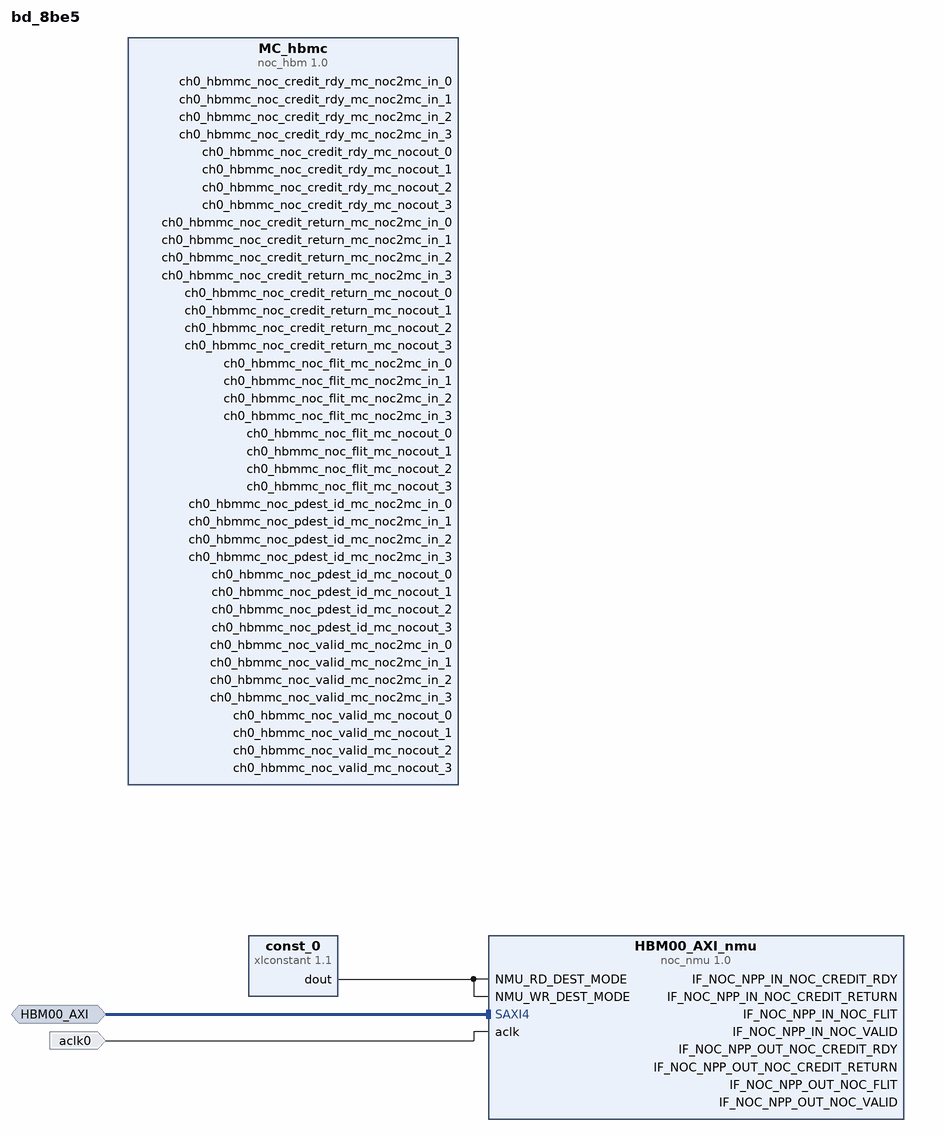
[diagram p0: block diagram of the top level]
# Vivado block design bd_8be5, xcvh1582-vsva3697-2MP-e-S, Vivado 2024.2
create_bd_design bd_8be5

create_bd_intf_port -mode Slave -vlnv xilinx.com:interface:aximm_rtl:1.0 HBM00_AXI
set_property -dict [list \
  CONFIG.CATEGORY pl_hbm \
  CONFIG.CONNECTIONS {HBM0_PORT0 {read_bw {12800} write_bw {12800} read_avg_burst {4} write_avg_burst {4}}} \
] [get_bd_intf_ports HBM00_AXI]
create_bd_port -dir I -type clk aclk0
set_property -dict {CONFIG.ASSOCIATED_BUSIF HBM00_AXI} [get_bd_ports aclk0]

create_bd_cell -type ip -vlnv xilinx.com:ip:noc_nmu:1.0 HBM00_AXI_nmu
set_property -dict [list \
  CONFIG.ATTR_FILE nocattrs.dat \
  CONFIG.IS_HBM true \
  CONFIG.USER_NOC_CATEGORY PL \
  CONFIG.USER_NOC_DATA512_WIDTH 256 \
  CONFIG.USER_NOC_NMU_WIDTH 256 \
  CONFIG.USER_PHYS_NAME NOC_NMU_HBM2E_X6Y0 \
  CONFIG.USER_REG_ADDR_DST0 0x00000 \
  CONFIG.USER_REG_ADDR_DST1 0x00000 \
  CONFIG.USER_REG_ADDR_DST2 0x00000 \
  CONFIG.USER_REG_ADDR_DST3 0x00000 \
  CONFIG.USER_REG_ADDR_DST4 0x00000 \
  CONFIG.USER_REG_ADDR_DST5 0x00000 \
  CONFIG.USER_REG_ADDR_DST6 0x00000 \
  CONFIG.USER_REG_ADDR_DST7 0x00000 \
  CONFIG.USER_REG_ADDR_DST8 0x00000 \
  CONFIG.USER_REG_ADDR_DST9 0x00000 \
  CONFIG.USER_REG_ADDR_DST10 0x00000 \
  CONFIG.USER_REG_ADDR_DST11 0x00000 \
  CONFIG.USER_REG_ADDR_DST12 0x00000 \
  CONFIG.USER_REG_ADDR_DST13 0x00000 \
  CONFIG.USER_REG_ADDR_DST14 0x00000 \
  CONFIG.USER_REG_ADDR_DST15 0x00000 \
  CONFIG.USER_REG_ADDR_ENABLE 0x0000 \
  CONFIG.USER_REG_ADDR_MADDR0 0x00000000 \
  CONFIG.USER_REG_ADDR_MADDR1 0x00000000 \
  CONFIG.USER_REG_ADDR_MADDR2 0x00000000 \
  CONFIG.USER_REG_ADDR_MADDR3 0x00000000 \
  CONFIG.USER_REG_ADDR_MADDR4 0x00000000 \
  CONFIG.USER_REG_ADDR_MADDR5 0x00000000 \
  CONFIG.USER_REG_ADDR_MADDR6 0x00000000 \
  CONFIG.USER_REG_ADDR_MADDR7 0x00000000 \
  CONFIG.USER_REG_ADDR_MADDR8 0x00000000 \
  CONFIG.USER_REG_ADDR_MADDR9 0x00000000 \
  CONFIG.USER_REG_ADDR_MADDR10 0x00000000 \
  CONFIG.USER_REG_ADDR_MADDR11 0x00000000 \
  CONFIG.USER_REG_ADDR_MADDR12 0x00000000 \
  CONFIG.USER_REG_ADDR_MADDR13 0x00000000 \
  CONFIG.USER_REG_ADDR_MADDR14 0x00000000 \
  CONFIG.USER_REG_ADDR_MADDR15 0x00000000 \
  CONFIG.USER_REG_ADDR_MASK0 0x00000000 \
  CONFIG.USER_REG_ADDR_MASK1 0x00000000 \
  CONFIG.USER_REG_ADDR_MASK2 0x00000000 \
  CONFIG.USER_REG_ADDR_MASK3 0x00000000 \
  CONFIG.USER_REG_ADDR_MASK4 0x00000000 \
  CONFIG.USER_REG_ADDR_MASK5 0x00000000 \
  CONFIG.USER_REG_ADDR_MASK6 0x00000000 \
  CONFIG.USER_REG_ADDR_MASK7 0x00000000 \
  CONFIG.USER_REG_ADDR_MASK8 0x00000000 \
  CONFIG.USER_REG_ADDR_MASK9 0x00000000 \
  CONFIG.USER_REG_ADDR_MASK10 0x00000000 \
  CONFIG.USER_REG_ADDR_MASK11 0x00000000 \
  CONFIG.USER_REG_ADDR_MASK12 0x00000000 \
  CONFIG.USER_REG_ADDR_MASK13 0x00000000 \
  CONFIG.USER_REG_ADDR_MASK14 0x00000000 \
  CONFIG.USER_REG_ADDR_MASK15 0x00000000 \
  CONFIG.USER_REG_ADDR_REMAP 0x0000 \
  CONFIG.USER_REG_ADDR_RPADDR0 0x00000000 \
  CONFIG.USER_REG_ADDR_RPADDR1 0x00000000 \
  CONFIG.USER_REG_ADDR_RPADDR2 0x00000000 \
  CONFIG.USER_REG_ADDR_RPADDR3 0x00000000 \
  CONFIG.USER_REG_ADDR_RPADDR4 0x00000000 \
  CONFIG.USER_REG_ADDR_RPADDR5 0x00000000 \
  CONFIG.USER_REG_ADDR_RPADDR6 0x00000000 \
  CONFIG.USER_REG_ADDR_RPADDR7 0x00000000 \
  CONFIG.USER_REG_ADDR_RPADDR8 0x00000000 \
  CONFIG.USER_REG_ADDR_RPADDR9 0x00000000 \
  CONFIG.USER_REG_ADDR_RPADDR10 0x00000000 \
  CONFIG.USER_REG_ADDR_RPADDR11 0x00000000 \
  CONFIG.USER_REG_ADDR_RPADDR12 0x00000000 \
  CONFIG.USER_REG_ADDR_RPADDR13 0x00000000 \
  CONFIG.USER_REG_ADDR_RPADDR14 0x00000000 \
  CONFIG.USER_REG_ADDR_RPADDR15 0x00000000 \
  CONFIG.USER_REG_ADR_MAP_CPM 0x0FC0 \
  CONFIG.USER_REG_ADR_MAP_FPD_AFI_0 0x0FC0 \
  CONFIG.USER_REG_ADR_MAP_FPD_AFI_1 0x0FC0 \
  CONFIG.USER_REG_ADR_MAP_LPD_AFI_FS 0x0FC0 \
  CONFIG.USER_REG_ADR_MAP_ME_ARRAY_0 0x0FC0 \
  CONFIG.USER_REG_ADR_MAP_ME_ARRAY_1 0x0FC0 \
  CONFIG.USER_REG_ADR_MAP_ME_ARRAY_2 0x0FC0 \
  CONFIG.USER_REG_ADR_MAP_ME_ARRAY_3 0x0FC0 \
  CONFIG.USER_REG_ADR_MAP_PCIE 0x0FC0 \
  CONFIG.USER_REG_ADR_MAP_PMC 0x0FC0 \
  CONFIG.USER_REG_ADR_MAP_PMC_ALIAS_0 0x0FC0 \
  CONFIG.USER_REG_ADR_MAP_PMC_ALIAS_1 0x0FC0 \
  CONFIG.USER_REG_ADR_MAP_PMC_ALIAS_2 0x0FC0 \
  CONFIG.USER_REG_ADR_MAP_PMC_ALIAS_3 0x0FC0 \
  CONFIG.USER_REG_ADR_MAP_QSPI 0x0FC0 \
  CONFIG.USER_REG_ADR_MAP_STM_GIC 0x0FC0 \
  CONFIG.USER_REG_ADR_MAP_USER_ID0 0x0000 \
  CONFIG.USER_REG_ADR_MAP_USER_ID1 0x0000 \
  CONFIG.USER_REG_ADR_MAP_USER_ID2 0x0000 \
  CONFIG.USER_REG_ADR_MAP_USER_ID3 0x0000 \
  CONFIG.USER_REG_ADR_MAP_USER_ID4 0x0000 \
  CONFIG.USER_REG_ADR_MAP_USER_ID5 0x0000 \
  CONFIG.USER_REG_ADR_MAP_USER_ID6 0x0000 \
  CONFIG.USER_REG_ADR_MAP_USER_ID7 0x0000 \
  CONFIG.USER_REG_ADR_MAP_XPDS 0x0FC0 \
  CONFIG.USER_REG_AXI_LOOPBACK 0x00 \
  CONFIG.USER_REG_AXI_NON_MOD_DISABLE 0x0 \
  CONFIG.USER_REG_AXI_PAR_CHK 0x0 \
  CONFIG.USER_REG_CHOPSIZE 0xA \
  CONFIG.USER_REG_DDR_ADR_MAP0 0x01FFF \
  CONFIG.USER_REG_DDR_ADR_MAP1 0x01FFF \
  CONFIG.USER_REG_DDR_ADR_MAP2 0x01FFF \
  CONFIG.USER_REG_DDR_ADR_MAP3 0x01FFF \
  CONFIG.USER_REG_DDR_ADR_MAP4 0x01FFF \
  CONFIG.USER_REG_DDR_ADR_MAP5 0x01FFF \
  CONFIG.USER_REG_DDR_ADR_MAP6 0x01FFF \
  CONFIG.USER_REG_DDR_DST_MAP0 0xFC0 \
  CONFIG.USER_REG_DDR_DST_MAP1 0xFC0 \
  CONFIG.USER_REG_DDR_DST_MAP2 0xFC0 \
  CONFIG.USER_REG_DDR_DST_MAP3 0xFC0 \
  CONFIG.USER_REG_DDR_DST_MAP4 0xFC0 \
  CONFIG.USER_REG_DDR_DST_MAP5 0xFC0 \
  CONFIG.USER_REG_DDR_DST_MAP6 0xFC0 \
  CONFIG.USER_REG_DDR_DST_MAP7 0xFC0 \
  CONFIG.USER_REG_DWIDTH 0x5 \
  CONFIG.USER_REG_ECC_CHK_EN 0x1 \
  CONFIG.USER_REG_HBM_MAP_T0_CH0 0x1080 \
  CONFIG.USER_REG_HBM_MAP_T0_CH1 0x0FC0 \
  CONFIG.USER_REG_HBM_MAP_T0_CH2 0x0FC0 \
  CONFIG.USER_REG_HBM_MAP_T0_CH3 0x0FC0 \
  CONFIG.USER_REG_HBM_MAP_T0_CH4 0x0FC0 \
  CONFIG.USER_REG_HBM_MAP_T0_CH5 0x0FC0 \
  CONFIG.USER_REG_HBM_MAP_T0_CH6 0x0FC0 \
  CONFIG.USER_REG_HBM_MAP_T0_CH7 0x0FC0 \
  CONFIG.USER_REG_HBM_MAP_T0_CH8 0x0FC0 \
  CONFIG.USER_REG_HBM_MAP_T0_CH9 0x0FC0 \
  CONFIG.USER_REG_HBM_MAP_T0_CH10 0x0FC0 \
  CONFIG.USER_REG_HBM_MAP_T0_CH11 0x0FC0 \
  CONFIG.USER_REG_HBM_MAP_T0_CH12 0x0FC0 \
  CONFIG.USER_REG_HBM_MAP_T0_CH13 0x0FC0 \
  CONFIG.USER_REG_HBM_MAP_T0_CH14 0x0FC0 \
  CONFIG.USER_REG_HBM_MAP_T0_CH15 0x0FC0 \
  CONFIG.USER_REG_HBM_MAP_T1_CH0 0x0FC0 \
  CONFIG.USER_REG_HBM_MAP_T1_CH1 0x0FC0 \
  CONFIG.USER_REG_HBM_MAP_T1_CH2 0x0FC0 \
  CONFIG.USER_REG_HBM_MAP_T1_CH3 0x0FC0 \
  CONFIG.USER_REG_HBM_MAP_T1_CH4 0x0FC0 \
  CONFIG.USER_REG_HBM_MAP_T1_CH5 0x0FC0 \
  CONFIG.USER_REG_HBM_MAP_T1_CH6 0x0FC0 \
  CONFIG.USER_REG_HBM_MAP_T1_CH7 0x0FC0 \
  CONFIG.USER_REG_HBM_MAP_T1_CH8 0x0FC0 \
  CONFIG.USER_REG_HBM_MAP_T1_CH9 0x0FC0 \
  CONFIG.USER_REG_HBM_MAP_T1_CH10 0x0FC0 \
  CONFIG.USER_REG_HBM_MAP_T1_CH11 0x0FC0 \
  CONFIG.USER_REG_HBM_MAP_T1_CH12 0x0FC0 \
  CONFIG.USER_REG_HBM_MAP_T1_CH13 0x0FC0 \
  CONFIG.USER_REG_HBM_MAP_T1_CH14 0x0FC0 \
  CONFIG.USER_REG_HBM_MAP_T1_CH15 0x0FC0 \
  CONFIG.USER_REG_HBM_MAP_T2_CH0 0x0FC0 \
  CONFIG.USER_REG_HBM_MAP_T2_CH1 0x0FC0 \
  CONFIG.USER_REG_HBM_MAP_T2_CH2 0x0FC0 \
  CONFIG.USER_REG_HBM_MAP_T2_CH3 0x0FC0 \
  CONFIG.USER_REG_HBM_MAP_T2_CH4 0x0FC0 \
  CONFIG.USER_REG_HBM_MAP_T2_CH5 0x0FC0 \
  CONFIG.USER_REG_HBM_MAP_T2_CH6 0x0FC0 \
  CONFIG.USER_REG_HBM_MAP_T2_CH7 0x0FC0 \
  CONFIG.USER_REG_HBM_MAP_T2_CH8 0x0FC0 \
  CONFIG.USER_REG_HBM_MAP_T2_CH9 0x0FC0 \
  CONFIG.USER_REG_HBM_MAP_T2_CH10 0x0FC0 \
  CONFIG.USER_REG_HBM_MAP_T2_CH11 0x0FC0 \
  CONFIG.USER_REG_HBM_MAP_T2_CH12 0x0FC0 \
  CONFIG.USER_REG_HBM_MAP_T2_CH13 0x0FC0 \
  CONFIG.USER_REG_HBM_MAP_T2_CH14 0x0FC0 \
  CONFIG.USER_REG_HBM_MAP_T2_CH15 0x0FC0 \
  CONFIG.USER_REG_HBM_MAP_T3_CH0 0x0FC0 \
  CONFIG.USER_REG_HBM_MAP_T3_CH1 0x0FC0 \
  CONFIG.USER_REG_HBM_MAP_T3_CH2 0x0FC0 \
  CONFIG.USER_REG_HBM_MAP_T3_CH3 0x0FC0 \
  CONFIG.USER_REG_HBM_MAP_T3_CH4 0x0FC0 \
  CONFIG.USER_REG_HBM_MAP_T3_CH5 0x0FC0 \
  CONFIG.USER_REG_HBM_MAP_T3_CH6 0x0FC0 \
  CONFIG.USER_REG_HBM_MAP_T3_CH7 0x0FC0 \
  CONFIG.USER_REG_HBM_MAP_T3_CH8 0x0FC0 \
  CONFIG.USER_REG_HBM_MAP_T3_CH9 0x0FC0 \
  CONFIG.USER_REG_HBM_MAP_T3_CH10 0x0FC0 \
  CONFIG.USER_REG_HBM_MAP_T3_CH11 0x0FC0 \
  CONFIG.USER_REG_HBM_MAP_T3_CH12 0x0FC0 \
  CONFIG.USER_REG_HBM_MAP_T3_CH13 0x0FC0 \
  CONFIG.USER_REG_HBM_MAP_T3_CH14 0x0FC0 \
  CONFIG.USER_REG_HBM_MAP_T3_CH15 0x0FC0 \
  CONFIG.USER_REG_HPHY_MODE 0x0 \
  CONFIG.USER_REG_MODE_SELECT 0x0020 \
  CONFIG.USER_REG_OUTSTANDING_RD_TXN 0x40 \
  CONFIG.USER_REG_OUTSTANDING_WR_TXN 0x40 \
  CONFIG.USER_REG_PRIORITY 0x0 \
  CONFIG.USER_REG_QOS 0x00 \
  CONFIG.USER_REG_RD_AXPROT_SEL 0x00 \
  CONFIG.USER_REG_RD_RATE_CREDIT_DROP 0x004 \
  CONFIG.USER_REG_RD_RATE_CREDIT_LIMIT 0x0100 \
  CONFIG.USER_REG_RD_VCA_TOKEN0 0x1C \
  CONFIG.USER_REG_RPOISON_TO_SLVERR 0x0 \
  CONFIG.USER_REG_RROB_RAM_SETTING 0x012 \
  CONFIG.USER_REG_SMID_SEL 0x00000 \
  CONFIG.USER_REG_SRC 0x040 \
  CONFIG.USER_REG_TBASE_AXI_TIMEOUT 0x1 \
  CONFIG.USER_REG_TBASE_MODE_RLIMIT_RD 0x2 \
  CONFIG.USER_REG_TBASE_MODE_RLIMIT_WR 0x2 \
  CONFIG.USER_REG_TBASE_TRK_TIMEOUT 0x1 \
  CONFIG.USER_REG_VC_MAP 0xFAC \
  CONFIG.USER_REG_WBUF_LAUNCH_SIZE 0x10 \
  CONFIG.USER_REG_WBUF_RAM_SETTING 0x012 \
  CONFIG.USER_REG_WR_AXPROT_SEL 0x00 \
  CONFIG.USER_REG_WR_RATE_CREDIT_DROP 0x004 \
  CONFIG.USER_REG_WR_RATE_CREDIT_LIMIT 0x0100 \
  CONFIG.USER_REG_WR_VCA_TOKEN0 0xFF \
] [get_bd_cells HBM00_AXI_nmu]
create_bd_cell -type ip -vlnv xilinx.com:ip:xlconstant:1.1 const_0
set_property -dict {CONFIG.CONST_VAL 0 CONFIG.CONST_WIDTH 1} [get_bd_cells const_0]
create_bd_cell -type ip -vlnv xilinx.com:ip:noc_hbm:1.0 MC_hbmc
set_property -dict [list \
  CONFIG.HBM_AP_BASE_CONFIG HBM_CHNL0_CONFIG \
  CONFIG.HBM_ATTR_FILE nocattrs.dat \
  CONFIG.HBM_AUTO_POPULATE yes \
  CONFIG.HBM_CHNL0_CONFIG {['HBM_REORDER_EN FALSE HBM_MAINTAIN_COHERENCY TRUE HBM_Q_AGE_LIMIT 0x7f HBM_CLOSE_PAGE_REORDER FALSE HBM_LOOKAHEAD_PCH TRUE HBM_COMMAND_PARITY FALSE HBM_DQ_WR_PARITY FALSE HBM_DQ_RD_PARITY FALSE', 'HBM_RD_DBI TRUE HBM_WR_DBI TRUE HBM_REFRESH_MODE ALL_BANK_REFRESH HBM_PC0_PRE_DEFINED_ADDRESS_MAP ROW_BANK_COLUMN_BGO HBM_PC1_PRE_DEFINED_ADDRESS_MAP ROW_BANK_COLUMN_BGO', 'HBM_PC0_USER_DEFINED_ADDRESS_MAP NONE HBM_PC1_USER_DEFINED_ADDRESS_MAP NONE HBM_PC0_ADDRESS_MAP', 'RA14,RA13,RA12,RA11,RA10,RA9,RA8,RA7,RA6,RA5,RA4,RA3,RA2,RA1,RA0,SID,BA1,BA0,BA3,CA5,CA4,CA3,CA2,CA1,BA2,NC,NA,NA,NA,NA HBM_PC1_ADDRESS_MAP', 'RA14,RA13,RA12,RA11,RA10,RA9,RA8,RA7,RA6,RA5,RA4,RA3,RA2,RA1,RA0,SID,BA1,BA0,BA3,CA5,CA4,CA3,CA2,CA1,BA2,NC,NA,NA,NA,NA HBM_PWR_DWN_IDLE_TIMEOUT_ENTRY FALSE HBM_SELF_REF_IDLE_TIMEOUT_ENTRY FALSE', 'HBM_IDLE_TIME_TO_ENTER_PWR_DWN_MODE 0x0001000 HBM_IDLE_TIME_TO_ENTER_SELF_REF_MODE 1X HBM_ECC_CORRECTION_EN FALSE HBM_WRITE_BACK_CORRECTED_DATA TRUE HBM_ECC_SCRUBBING FALSE HBM_ECC_INITIALIZE_EN FALSE', 'HBM_ECC_SCRUB_SIZE 1092 HBM_WRITE_DATA_MASK TRUE HBM_REF_PERIOD_TEMP_COMP FALSE HBM_PARITY_LATENCY 3 HBM_PC0_PAGE_HIT 100.000 HBM_PC1_PAGE_HIT 100.000 HBM_PC0_READ_RATE 25.000 HBM_PC1_READ_RATE 25.000', 'HBM_PC0_WRITE_RATE 25.000 HBM_PC1_WRITE_RATE 25.000 HBM_PC0_PHY_ACTIVE ENABLED HBM_PC1_PHY_ACTIVE ENABLED HBM_PC0_SCRUB_START_ADDRESS 0x0000000 HBM_PC0_SCRUB_END_ADDRESS 0x3FFFBFF', 'HBM_PC0_SCRUB_INTERVAL 24.000 HBM_PC1_SCRUB_START_ADDRESS 0x0000000 HBM_PC1_SCRUB_END_ADDRESS 0x3FFFBFF HBM_PC1_SCRUB_INTERVAL 24.000']} \
  CONFIG.HBM_CHNL0_NA0_CONFIG {['HBMMC_NA0_NA_VC_MAP 0x0000000f HBMMC_NA0_NA_DEST_ID 0x00000080 HBMMC_NA0_PORT_INTERLEAVE 0x00000000 HBMMC_NA0_SCRUB_START_ADDRESS 0x00000000 HBMMC_NA0_SCRUB_END_ADDRESS 0x0000000e', 'HBMMC_NA0_SCRUB_FREQUENCY 0x003edd41 HBMMC_NA0_EXMON_CLR_EXE_CFG_DYN_MCP3 0x00000100 HBMMC_NA0_RD_CMD_MODE_CFG_MCP 0x00000000 HBMMC_NA0_WRCMD_PIPELINE_TIMEOUT_VALUE_CFG_MCP 0x00000000', 'HBMMC_NA0_WRCMD_PIPELINE_TIMEOUT_ENABLE_CFG_MCP 0x00000000 HBMMC_NA0_NA_ERR_INJ 0x00000000 HBMMC_NA0_NA_NSU_FORCE_ECC_FLIT_ERR 0x00000000 HBMMC_NA0_NA_PM_FILTR_P0 0x00000000', 'HBMMC_NA0_NA_PM_SMID_FILTR_P0 0x00000000 HBMMC_NA0_NA_PM_FILTR_EN_P0 0x00000000 HBMMC_NA0_NA_PM_FILTR_P1 0x00000000 HBMMC_NA0_NA_PM_SMID_FILTR_P1 0x00000000 HBMMC_NA0_NA_PM_FILTR_EN_P1 0x00000000', 'HBMMC_NA0_TGC_CONFIG 0x00000000 HBMMC_NA0_XMPU_CTRL_CFG_DYN_MCP3 0x0000000b HBMMC_NA0_XMPU_START_LO0_CFG_DYN_MCP3 0x00000000 HBMMC_NA0_XMPU_START_HI0_CFG_DYN_MCP3 0x00000000', 'HBMMC_NA0_XMPU_END_LO0_CFG_DYN_MCP3 0x00000000 HBMMC_NA0_XMPU_END_HI0_CFG_DYN_MCP3 0x00000000 HBMMC_NA0_XMPU_MASTER0_CFG_DYN_MCP3 0x00000000 HBMMC_NA0_XMPU_CONFIG0_CFG_DYN_MCP3 0x00000008', 'HBMMC_NA0_XMPU_START_LO1_CFG_DYN_MCP3 0x00000000 HBMMC_NA0_XMPU_START_HI1_CFG_DYN_MCP3 0x00000000 HBMMC_NA0_XMPU_END_LO1_CFG_DYN_MCP3 0x00000000 HBMMC_NA0_XMPU_END_HI1_CFG_DYN_MCP3 0x00000000', 'HBMMC_NA0_XMPU_MASTER1_CFG_DYN_MCP3 0x00000000 HBMMC_NA0_XMPU_CONFIG1_CFG_DYN_MCP3 0x00000008']} \
  CONFIG.HBM_CHNL0_NA1_CONFIG {['HBMMC_NA1_NA_VC_MAP 0x00000000 HBMMC_NA1_NA_DEST_ID 0x00000000 HBMMC_NA1_PORT_INTERLEAVE 0x00000000 HBMMC_NA1_SCRUB_START_ADDRESS 0x00000000 HBMMC_NA1_SCRUB_END_ADDRESS 0x0000000e', 'HBMMC_NA1_SCRUB_FREQUENCY 0x003edd41 HBMMC_NA1_EXMON_CLR_EXE_CFG_DYN_MCP3 0x00000100 HBMMC_NA1_RD_CMD_MODE_CFG_MCP 0x00000000 HBMMC_NA1_WRCMD_PIPELINE_TIMEOUT_VALUE_CFG_MCP 0x00000000', 'HBMMC_NA1_WRCMD_PIPELINE_TIMEOUT_ENABLE_CFG_MCP 0x00000000 HBMMC_NA1_NA_ERR_INJ 0x00000000 HBMMC_NA1_NA_NSU_FORCE_ECC_FLIT_ERR 0x00000000 HBMMC_NA1_NA_PM_FILTR_P0 0x00000000', 'HBMMC_NA1_NA_PM_SMID_FILTR_P0 0x00000000 HBMMC_NA1_NA_PM_FILTR_EN_P0 0x00000000 HBMMC_NA1_NA_PM_FILTR_P1 0x00000000 HBMMC_NA1_NA_PM_SMID_FILTR_P1 0x00000000 HBMMC_NA1_NA_PM_FILTR_EN_P1 0x00000000', 'HBMMC_NA1_TGC_CONFIG 0x00000000 HBMMC_NA1_XMPU_CTRL_CFG_DYN_MCP3 0x0000000b HBMMC_NA1_XMPU_START_LO0_CFG_DYN_MCP3 0x00000000 HBMMC_NA1_XMPU_START_HI0_CFG_DYN_MCP3 0x00000000', 'HBMMC_NA1_XMPU_END_LO0_CFG_DYN_MCP3 0x00000000 HBMMC_NA1_XMPU_END_HI0_CFG_DYN_MCP3 0x00000000 HBMMC_NA1_XMPU_MASTER0_CFG_DYN_MCP3 0x00000000 HBMMC_NA1_XMPU_CONFIG0_CFG_DYN_MCP3 0x00000008', 'HBMMC_NA1_XMPU_START_LO1_CFG_DYN_MCP3 0x00000000 HBMMC_NA1_XMPU_START_HI1_CFG_DYN_MCP3 0x00000000 HBMMC_NA1_XMPU_END_LO1_CFG_DYN_MCP3 0x00000000 HBMMC_NA1_XMPU_CONFIG1_CFG_DYN_MCP3 0x00000008']} \
  CONFIG.HBM_CHNL10_CONFIG { } \
  CONFIG.HBM_CHNL11_CONFIG { } \
  CONFIG.HBM_CHNL12_CONFIG { } \
  CONFIG.HBM_CHNL13_CONFIG { } \
  CONFIG.HBM_CHNL14_CONFIG { } \
  CONFIG.HBM_CHNL15_CONFIG { } \
  CONFIG.HBM_CHNL1_CONFIG { } \
  CONFIG.HBM_CHNL2_CONFIG { } \
  CONFIG.HBM_CHNL3_CONFIG { } \
  CONFIG.HBM_CHNL4_CONFIG { } \
  CONFIG.HBM_CHNL5_CONFIG { } \
  CONFIG.HBM_CHNL6_CONFIG { } \
  CONFIG.HBM_CHNL7_CONFIG { } \
  CONFIG.HBM_CHNL8_CONFIG { } \
  CONFIG.HBM_CHNL9_CONFIG { } \
  CONFIG.HBM_CHNL_EN_0 true \
  CONFIG.HBM_CHNL_EN_1 false \
  CONFIG.HBM_CHNL_EN_2 false \
  CONFIG.HBM_CHNL_EN_3 false \
  CONFIG.HBM_CHNL_EN_4 false \
  CONFIG.HBM_CHNL_EN_5 false \
  CONFIG.HBM_CHNL_EN_6 false \
  CONFIG.HBM_CHNL_EN_7 false \
  CONFIG.HBM_CHNL_EN_8 false \
  CONFIG.HBM_CHNL_EN_9 false \
  CONFIG.HBM_CHNL_EN_10 false \
  CONFIG.HBM_CHNL_EN_11 false \
  CONFIG.HBM_CHNL_EN_12 false \
  CONFIG.HBM_CHNL_EN_13 false \
  CONFIG.HBM_CHNL_EN_14 false \
  CONFIG.HBM_CHNL_EN_15 false \
  CONFIG.HBM_CHNL_PARAM 0 \
  CONFIG.HBM_CTRL_PHY_MODE Controller_and_Physical_Layer \
  CONFIG.HBM_DFI_CLK_DIV2_EN false \
  CONFIG.HBM_EXT_REFCLK_IO_STANDARD NONE \
  CONFIG.HBM_FCV_PARAM Disable \
  CONFIG.HBM_GBL_REF_RST_EN false \
  CONFIG.HBM_HPLL_TEST_PORTS_EN false \
  CONFIG.HBM_MEMORY_FREQ0 1600 \
  CONFIG.HBM_MEMORY_FREQ1 1600 \
  CONFIG.HBM_MEMORY_MODEL xilinx_responder \
  CONFIG.HBM_MEM_BACKDOOR_WRITE false \
  CONFIG.HBM_MEM_INIT_FILE no_file_loaded \
  CONFIG.HBM_MEM_INIT_MODE INIT_0 \
  CONFIG.HBM_OVERWRITE_PORTCONTROL_REG false \
  CONFIG.HBM_PHYIO_CNTRL_BLOCK false \
  CONFIG.HBM_PHY_DEBUG_PORTS_EN false \
  CONFIG.HBM_PHY_EN_0 false \
  CONFIG.HBM_PHY_EN_1 false \
  CONFIG.HBM_PHY_EN_2 false \
  CONFIG.HBM_PHY_EN_3 false \
  CONFIG.HBM_PHY_EN_4 false \
  CONFIG.HBM_PHY_EN_5 false \
  CONFIG.HBM_PHY_EN_6 false \
  CONFIG.HBM_PHY_EN_7 false \
  CONFIG.HBM_PHY_EN_8 false \
  CONFIG.HBM_PHY_EN_9 false \
  CONFIG.HBM_PHY_EN_10 false \
  CONFIG.HBM_PHY_EN_11 false \
  CONFIG.HBM_PHY_EN_12 false \
  CONFIG.HBM_PHY_EN_13 false \
  CONFIG.HBM_PHY_EN_14 false \
  CONFIG.HBM_PHY_EN_15 false \
  CONFIG.HBM_REF_CLK_FREQ0 100.000 \
  CONFIG.HBM_REF_CLK_FREQ1 100.000 \
  CONFIG.HBM_REF_CLK_SELECTION Internal \
  CONFIG.HBM_SIMULATION_MODE BFM \
  CONFIG.HBM_STACK0_CONFIG 0 \
  CONFIG.HBM_STACKS 1 \
  CONFIG.HBM_VNC_EN false \
] [get_bd_cells MC_hbmc]

# ---- connections ----

connect_bd_intf_net [get_bd_intf_ports HBM00_AXI] [get_bd_intf_pins HBM00_AXI_nmu/SAXI4]
connect_bd_net -net aclk0_1 [get_bd_ports aclk0] [get_bd_pins HBM00_AXI_nmu/aclk]
connect_bd_net [get_bd_pins const_0/dout] [get_bd_pins HBM00_AXI_nmu/NMU_RD_DEST_MODE] [get_bd_pins HBM00_AXI_nmu/NMU_WR_DEST_MODE]
# net hbm00_axi_nmu_if_noc_npp_in_noc_credit_rdy has one end: HBM00_AXI_nmu/IF_NOC_NPP_IN_NOC_CREDIT_RDY
# net hbm00_axi_nmu_if_noc_npp_in_noc_credit_return has one end: HBM00_AXI_nmu/IF_NOC_NPP_IN_NOC_CREDIT_RETURN
# net hbm00_axi_nmu_if_noc_npp_in_noc_flit has one end: HBM00_AXI_nmu/IF_NOC_NPP_IN_NOC_FLIT
# net hbm00_axi_nmu_if_noc_npp_in_noc_valid has one end: HBM00_AXI_nmu/IF_NOC_NPP_IN_NOC_VALID
# net hbm00_axi_nmu_if_noc_npp_out_noc_credit_rdy has one end: HBM00_AXI_nmu/IF_NOC_NPP_OUT_NOC_CREDIT_RDY
# net hbm00_axi_nmu_if_noc_npp_out_noc_credit_return has one end: HBM00_AXI_nmu/IF_NOC_NPP_OUT_NOC_CREDIT_RETURN
# net hbm00_axi_nmu_if_noc_npp_out_noc_flit has one end: HBM00_AXI_nmu/IF_NOC_NPP_OUT_NOC_FLIT
# net hbm00_axi_nmu_if_noc_npp_out_noc_valid has one end: HBM00_AXI_nmu/IF_NOC_NPP_OUT_NOC_VALID
# net mc_hbmc_ch0_hbmmc_noc_credit_rdy_mc_noc2mc_in_0 has one end: MC_hbmc/ch0_hbmmc_noc_credit_rdy_mc_noc2mc_in_0
# net mc_hbmc_ch0_hbmmc_noc_credit_rdy_mc_noc2mc_in_1 has one end: MC_hbmc/ch0_hbmmc_noc_credit_rdy_mc_noc2mc_in_1
# net mc_hbmc_ch0_hbmmc_noc_credit_rdy_mc_noc2mc_in_2 has one end: MC_hbmc/ch0_hbmmc_noc_credit_rdy_mc_noc2mc_in_2
# net mc_hbmc_ch0_hbmmc_noc_credit_rdy_mc_noc2mc_in_3 has one end: MC_hbmc/ch0_hbmmc_noc_credit_rdy_mc_noc2mc_in_3
# net mc_hbmc_ch0_hbmmc_noc_credit_rdy_mc_nocout_0 has one end: MC_hbmc/ch0_hbmmc_noc_credit_rdy_mc_nocout_0
# net mc_hbmc_ch0_hbmmc_noc_credit_rdy_mc_nocout_1 has one end: MC_hbmc/ch0_hbmmc_noc_credit_rdy_mc_nocout_1
# net mc_hbmc_ch0_hbmmc_noc_credit_rdy_mc_nocout_2 has one end: MC_hbmc/ch0_hbmmc_noc_credit_rdy_mc_nocout_2
# net mc_hbmc_ch0_hbmmc_noc_credit_rdy_mc_nocout_3 has one end: MC_hbmc/ch0_hbmmc_noc_credit_rdy_mc_nocout_3
# net mc_hbmc_ch0_hbmmc_noc_credit_return_mc_noc2mc_in_0 has one end: MC_hbmc/ch0_hbmmc_noc_credit_return_mc_noc2mc_in_0
# net mc_hbmc_ch0_hbmmc_noc_credit_return_mc_noc2mc_in_1 has one end: MC_hbmc/ch0_hbmmc_noc_credit_return_mc_noc2mc_in_1
# net mc_hbmc_ch0_hbmmc_noc_credit_return_mc_noc2mc_in_2 has one end: MC_hbmc/ch0_hbmmc_noc_credit_return_mc_noc2mc_in_2
# net mc_hbmc_ch0_hbmmc_noc_credit_return_mc_noc2mc_in_3 has one end: MC_hbmc/ch0_hbmmc_noc_credit_return_mc_noc2mc_in_3
# net mc_hbmc_ch0_hbmmc_noc_credit_return_mc_nocout_0 has one end: MC_hbmc/ch0_hbmmc_noc_credit_return_mc_nocout_0
# net mc_hbmc_ch0_hbmmc_noc_credit_return_mc_nocout_1 has one end: MC_hbmc/ch0_hbmmc_noc_credit_return_mc_nocout_1
# net mc_hbmc_ch0_hbmmc_noc_credit_return_mc_nocout_2 has one end: MC_hbmc/ch0_hbmmc_noc_credit_return_mc_nocout_2
# net mc_hbmc_ch0_hbmmc_noc_credit_return_mc_nocout_3 has one end: MC_hbmc/ch0_hbmmc_noc_credit_return_mc_nocout_3
# net mc_hbmc_ch0_hbmmc_noc_flit_mc_noc2mc_in_0 has one end: MC_hbmc/ch0_hbmmc_noc_flit_mc_noc2mc_in_0
# net mc_hbmc_ch0_hbmmc_noc_flit_mc_noc2mc_in_1 has one end: MC_hbmc/ch0_hbmmc_noc_flit_mc_noc2mc_in_1
# net mc_hbmc_ch0_hbmmc_noc_flit_mc_noc2mc_in_2 has one end: MC_hbmc/ch0_hbmmc_noc_flit_mc_noc2mc_in_2
# net mc_hbmc_ch0_hbmmc_noc_flit_mc_noc2mc_in_3 has one end: MC_hbmc/ch0_hbmmc_noc_flit_mc_noc2mc_in_3
# net mc_hbmc_ch0_hbmmc_noc_flit_mc_nocout_0 has one end: MC_hbmc/ch0_hbmmc_noc_flit_mc_nocout_0
# net mc_hbmc_ch0_hbmmc_noc_flit_mc_nocout_1 has one end: MC_hbmc/ch0_hbmmc_noc_flit_mc_nocout_1
# net mc_hbmc_ch0_hbmmc_noc_flit_mc_nocout_2 has one end: MC_hbmc/ch0_hbmmc_noc_flit_mc_nocout_2
# net mc_hbmc_ch0_hbmmc_noc_flit_mc_nocout_3 has one end: MC_hbmc/ch0_hbmmc_noc_flit_mc_nocout_3
# net mc_hbmc_ch0_hbmmc_noc_pdest_id_mc_noc2mc_in_0 has one end: MC_hbmc/ch0_hbmmc_noc_pdest_id_mc_noc2mc_in_0
# net mc_hbmc_ch0_hbmmc_noc_pdest_id_mc_noc2mc_in_1 has one end: MC_hbmc/ch0_hbmmc_noc_pdest_id_mc_noc2mc_in_1
# net mc_hbmc_ch0_hbmmc_noc_pdest_id_mc_noc2mc_in_2 has one end: MC_hbmc/ch0_hbmmc_noc_pdest_id_mc_noc2mc_in_2
# net mc_hbmc_ch0_hbmmc_noc_pdest_id_mc_noc2mc_in_3 has one end: MC_hbmc/ch0_hbmmc_noc_pdest_id_mc_noc2mc_in_3
# net mc_hbmc_ch0_hbmmc_noc_pdest_id_mc_nocout_0 has one end: MC_hbmc/ch0_hbmmc_noc_pdest_id_mc_nocout_0
# net mc_hbmc_ch0_hbmmc_noc_pdest_id_mc_nocout_1 has one end: MC_hbmc/ch0_hbmmc_noc_pdest_id_mc_nocout_1
# net mc_hbmc_ch0_hbmmc_noc_pdest_id_mc_nocout_2 has one end: MC_hbmc/ch0_hbmmc_noc_pdest_id_mc_nocout_2
# net mc_hbmc_ch0_hbmmc_noc_pdest_id_mc_nocout_3 has one end: MC_hbmc/ch0_hbmmc_noc_pdest_id_mc_nocout_3
# net mc_hbmc_ch0_hbmmc_noc_valid_mc_noc2mc_in_0 has one end: MC_hbmc/ch0_hbmmc_noc_valid_mc_noc2mc_in_0
# net mc_hbmc_ch0_hbmmc_noc_valid_mc_noc2mc_in_1 has one end: MC_hbmc/ch0_hbmmc_noc_valid_mc_noc2mc_in_1
# net mc_hbmc_ch0_hbmmc_noc_valid_mc_noc2mc_in_2 has one end: MC_hbmc/ch0_hbmmc_noc_valid_mc_noc2mc_in_2
# net mc_hbmc_ch0_hbmmc_noc_valid_mc_noc2mc_in_3 has one end: MC_hbmc/ch0_hbmmc_noc_valid_mc_noc2mc_in_3
# net mc_hbmc_ch0_hbmmc_noc_valid_mc_nocout_0 has one end: MC_hbmc/ch0_hbmmc_noc_valid_mc_nocout_0
# net mc_hbmc_ch0_hbmmc_noc_valid_mc_nocout_1 has one end: MC_hbmc/ch0_hbmmc_noc_valid_mc_nocout_1
# net mc_hbmc_ch0_hbmmc_noc_valid_mc_nocout_2 has one end: MC_hbmc/ch0_hbmmc_noc_valid_mc_nocout_2
# net mc_hbmc_ch0_hbmmc_noc_valid_mc_nocout_3 has one end: MC_hbmc/ch0_hbmmc_noc_valid_mc_nocout_3
set_property HDL_ATTRIBUTE.DONT_TOUCH true [get_bd_cells HBM00_AXI_nmu]
set_property HDL_ATTRIBUTE.DONT_TOUCH true [get_bd_cells const_0]
set_property HDL_ATTRIBUTE.DONT_TOUCH true [get_bd_cells MC_hbmc]
set_property HDL_ATTRIBUTE.EXT_CONN TRUE [get_bd_nets hbm00_axi_nmu_if_noc_npp_in_noc_credit_rdy]
set_property HDL_ATTRIBUTE.HIDDEN TRUE [get_bd_nets hbm00_axi_nmu_if_noc_npp_in_noc_credit_rdy]
set_property HDL_ATTRIBUTE.SIM_ONLY TRUE [get_bd_nets hbm00_axi_nmu_if_noc_npp_in_noc_credit_rdy]
set_property HDL_ATTRIBUTE.EXT_CONN TRUE [get_bd_nets hbm00_axi_nmu_if_noc_npp_in_noc_credit_return]
set_property HDL_ATTRIBUTE.HIDDEN TRUE [get_bd_nets hbm00_axi_nmu_if_noc_npp_in_noc_credit_return]
set_property HDL_ATTRIBUTE.SIM_ONLY TRUE [get_bd_nets hbm00_axi_nmu_if_noc_npp_in_noc_credit_return]
set_property HDL_ATTRIBUTE.EXT_CONN TRUE [get_bd_nets hbm00_axi_nmu_if_noc_npp_in_noc_flit]
set_property HDL_ATTRIBUTE.HIDDEN TRUE [get_bd_nets hbm00_axi_nmu_if_noc_npp_in_noc_flit]
set_property HDL_ATTRIBUTE.SIM_ONLY TRUE [get_bd_nets hbm00_axi_nmu_if_noc_npp_in_noc_flit]
set_property HDL_ATTRIBUTE.EXT_CONN TRUE [get_bd_nets hbm00_axi_nmu_if_noc_npp_in_noc_valid]
set_property HDL_ATTRIBUTE.HIDDEN TRUE [get_bd_nets hbm00_axi_nmu_if_noc_npp_in_noc_valid]
set_property HDL_ATTRIBUTE.SIM_ONLY TRUE [get_bd_nets hbm00_axi_nmu_if_noc_npp_in_noc_valid]
set_property HDL_ATTRIBUTE.EXT_CONN TRUE [get_bd_nets hbm00_axi_nmu_if_noc_npp_out_noc_credit_rdy]
set_property HDL_ATTRIBUTE.HIDDEN TRUE [get_bd_nets hbm00_axi_nmu_if_noc_npp_out_noc_credit_rdy]
set_property HDL_ATTRIBUTE.SIM_ONLY TRUE [get_bd_nets hbm00_axi_nmu_if_noc_npp_out_noc_credit_rdy]
set_property HDL_ATTRIBUTE.EXT_CONN TRUE [get_bd_nets hbm00_axi_nmu_if_noc_npp_out_noc_credit_return]
set_property HDL_ATTRIBUTE.HIDDEN TRUE [get_bd_nets hbm00_axi_nmu_if_noc_npp_out_noc_credit_return]
set_property HDL_ATTRIBUTE.SIM_ONLY TRUE [get_bd_nets hbm00_axi_nmu_if_noc_npp_out_noc_credit_return]
set_property HDL_ATTRIBUTE.EXT_CONN TRUE [get_bd_nets hbm00_axi_nmu_if_noc_npp_out_noc_flit]
set_property HDL_ATTRIBUTE.HIDDEN TRUE [get_bd_nets hbm00_axi_nmu_if_noc_npp_out_noc_flit]
set_property HDL_ATTRIBUTE.SIM_ONLY TRUE [get_bd_nets hbm00_axi_nmu_if_noc_npp_out_noc_flit]
set_property HDL_ATTRIBUTE.EXT_CONN TRUE [get_bd_nets hbm00_axi_nmu_if_noc_npp_out_noc_valid]
set_property HDL_ATTRIBUTE.HIDDEN TRUE [get_bd_nets hbm00_axi_nmu_if_noc_npp_out_noc_valid]
set_property HDL_ATTRIBUTE.SIM_ONLY TRUE [get_bd_nets hbm00_axi_nmu_if_noc_npp_out_noc_valid]
set_property HDL_ATTRIBUTE.EXT_CONN TRUE [get_bd_nets mc_hbmc_ch0_hbmmc_noc_credit_rdy_mc_noc2mc_in_0]
set_property HDL_ATTRIBUTE.HIDDEN TRUE [get_bd_nets mc_hbmc_ch0_hbmmc_noc_credit_rdy_mc_noc2mc_in_0]
set_property HDL_ATTRIBUTE.SIM_ONLY TRUE [get_bd_nets mc_hbmc_ch0_hbmmc_noc_credit_rdy_mc_noc2mc_in_0]
set_property HDL_ATTRIBUTE.EXT_CONN TRUE [get_bd_nets mc_hbmc_ch0_hbmmc_noc_credit_rdy_mc_noc2mc_in_1]
set_property HDL_ATTRIBUTE.HIDDEN TRUE [get_bd_nets mc_hbmc_ch0_hbmmc_noc_credit_rdy_mc_noc2mc_in_1]
set_property HDL_ATTRIBUTE.SIM_ONLY TRUE [get_bd_nets mc_hbmc_ch0_hbmmc_noc_credit_rdy_mc_noc2mc_in_1]
set_property HDL_ATTRIBUTE.EXT_CONN TRUE [get_bd_nets mc_hbmc_ch0_hbmmc_noc_credit_rdy_mc_noc2mc_in_2]
set_property HDL_ATTRIBUTE.HIDDEN TRUE [get_bd_nets mc_hbmc_ch0_hbmmc_noc_credit_rdy_mc_noc2mc_in_2]
set_property HDL_ATTRIBUTE.SIM_ONLY TRUE [get_bd_nets mc_hbmc_ch0_hbmmc_noc_credit_rdy_mc_noc2mc_in_2]
set_property HDL_ATTRIBUTE.EXT_CONN TRUE [get_bd_nets mc_hbmc_ch0_hbmmc_noc_credit_rdy_mc_noc2mc_in_3]
set_property HDL_ATTRIBUTE.HIDDEN TRUE [get_bd_nets mc_hbmc_ch0_hbmmc_noc_credit_rdy_mc_noc2mc_in_3]
set_property HDL_ATTRIBUTE.SIM_ONLY TRUE [get_bd_nets mc_hbmc_ch0_hbmmc_noc_credit_rdy_mc_noc2mc_in_3]
set_property HDL_ATTRIBUTE.EXT_CONN TRUE [get_bd_nets mc_hbmc_ch0_hbmmc_noc_credit_rdy_mc_nocout_0]
set_property HDL_ATTRIBUTE.HIDDEN TRUE [get_bd_nets mc_hbmc_ch0_hbmmc_noc_credit_rdy_mc_nocout_0]
set_property HDL_ATTRIBUTE.SIM_ONLY TRUE [get_bd_nets mc_hbmc_ch0_hbmmc_noc_credit_rdy_mc_nocout_0]
set_property HDL_ATTRIBUTE.EXT_CONN TRUE [get_bd_nets mc_hbmc_ch0_hbmmc_noc_credit_rdy_mc_nocout_1]
set_property HDL_ATTRIBUTE.HIDDEN TRUE [get_bd_nets mc_hbmc_ch0_hbmmc_noc_credit_rdy_mc_nocout_1]
set_property HDL_ATTRIBUTE.SIM_ONLY TRUE [get_bd_nets mc_hbmc_ch0_hbmmc_noc_credit_rdy_mc_nocout_1]
set_property HDL_ATTRIBUTE.EXT_CONN TRUE [get_bd_nets mc_hbmc_ch0_hbmmc_noc_credit_rdy_mc_nocout_2]
set_property HDL_ATTRIBUTE.HIDDEN TRUE [get_bd_nets mc_hbmc_ch0_hbmmc_noc_credit_rdy_mc_nocout_2]
set_property HDL_ATTRIBUTE.SIM_ONLY TRUE [get_bd_nets mc_hbmc_ch0_hbmmc_noc_credit_rdy_mc_nocout_2]
set_property HDL_ATTRIBUTE.EXT_CONN TRUE [get_bd_nets mc_hbmc_ch0_hbmmc_noc_credit_rdy_mc_nocout_3]
set_property HDL_ATTRIBUTE.HIDDEN TRUE [get_bd_nets mc_hbmc_ch0_hbmmc_noc_credit_rdy_mc_nocout_3]
set_property HDL_ATTRIBUTE.SIM_ONLY TRUE [get_bd_nets mc_hbmc_ch0_hbmmc_noc_credit_rdy_mc_nocout_3]
set_property HDL_ATTRIBUTE.EXT_CONN TRUE [get_bd_nets mc_hbmc_ch0_hbmmc_noc_credit_return_mc_noc2mc_in_0]
set_property HDL_ATTRIBUTE.HIDDEN TRUE [get_bd_nets mc_hbmc_ch0_hbmmc_noc_credit_return_mc_noc2mc_in_0]
set_property HDL_ATTRIBUTE.SIM_ONLY TRUE [get_bd_nets mc_hbmc_ch0_hbmmc_noc_credit_return_mc_noc2mc_in_0]
set_property HDL_ATTRIBUTE.EXT_CONN TRUE [get_bd_nets mc_hbmc_ch0_hbmmc_noc_credit_return_mc_noc2mc_in_1]
set_property HDL_ATTRIBUTE.HIDDEN TRUE [get_bd_nets mc_hbmc_ch0_hbmmc_noc_credit_return_mc_noc2mc_in_1]
set_property HDL_ATTRIBUTE.SIM_ONLY TRUE [get_bd_nets mc_hbmc_ch0_hbmmc_noc_credit_return_mc_noc2mc_in_1]
set_property HDL_ATTRIBUTE.EXT_CONN TRUE [get_bd_nets mc_hbmc_ch0_hbmmc_noc_credit_return_mc_noc2mc_in_2]
set_property HDL_ATTRIBUTE.HIDDEN TRUE [get_bd_nets mc_hbmc_ch0_hbmmc_noc_credit_return_mc_noc2mc_in_2]
set_property HDL_ATTRIBUTE.SIM_ONLY TRUE [get_bd_nets mc_hbmc_ch0_hbmmc_noc_credit_return_mc_noc2mc_in_2]
set_property HDL_ATTRIBUTE.EXT_CONN TRUE [get_bd_nets mc_hbmc_ch0_hbmmc_noc_credit_return_mc_noc2mc_in_3]
set_property HDL_ATTRIBUTE.HIDDEN TRUE [get_bd_nets mc_hbmc_ch0_hbmmc_noc_credit_return_mc_noc2mc_in_3]
set_property HDL_ATTRIBUTE.SIM_ONLY TRUE [get_bd_nets mc_hbmc_ch0_hbmmc_noc_credit_return_mc_noc2mc_in_3]
set_property HDL_ATTRIBUTE.EXT_CONN TRUE [get_bd_nets mc_hbmc_ch0_hbmmc_noc_credit_return_mc_nocout_0]
set_property HDL_ATTRIBUTE.HIDDEN TRUE [get_bd_nets mc_hbmc_ch0_hbmmc_noc_credit_return_mc_nocout_0]
set_property HDL_ATTRIBUTE.SIM_ONLY TRUE [get_bd_nets mc_hbmc_ch0_hbmmc_noc_credit_return_mc_nocout_0]
set_property HDL_ATTRIBUTE.EXT_CONN TRUE [get_bd_nets mc_hbmc_ch0_hbmmc_noc_credit_return_mc_nocout_1]
set_property HDL_ATTRIBUTE.HIDDEN TRUE [get_bd_nets mc_hbmc_ch0_hbmmc_noc_credit_return_mc_nocout_1]
set_property HDL_ATTRIBUTE.SIM_ONLY TRUE [get_bd_nets mc_hbmc_ch0_hbmmc_noc_credit_return_mc_nocout_1]
set_property HDL_ATTRIBUTE.EXT_CONN TRUE [get_bd_nets mc_hbmc_ch0_hbmmc_noc_credit_return_mc_nocout_2]
set_property HDL_ATTRIBUTE.HIDDEN TRUE [get_bd_nets mc_hbmc_ch0_hbmmc_noc_credit_return_mc_nocout_2]
set_property HDL_ATTRIBUTE.SIM_ONLY TRUE [get_bd_nets mc_hbmc_ch0_hbmmc_noc_credit_return_mc_nocout_2]
set_property HDL_ATTRIBUTE.EXT_CONN TRUE [get_bd_nets mc_hbmc_ch0_hbmmc_noc_credit_return_mc_nocout_3]
set_property HDL_ATTRIBUTE.HIDDEN TRUE [get_bd_nets mc_hbmc_ch0_hbmmc_noc_credit_return_mc_nocout_3]
set_property HDL_ATTRIBUTE.SIM_ONLY TRUE [get_bd_nets mc_hbmc_ch0_hbmmc_noc_credit_return_mc_nocout_3]
set_property HDL_ATTRIBUTE.EXT_CONN TRUE [get_bd_nets mc_hbmc_ch0_hbmmc_noc_flit_mc_noc2mc_in_0]
set_property HDL_ATTRIBUTE.HIDDEN TRUE [get_bd_nets mc_hbmc_ch0_hbmmc_noc_flit_mc_noc2mc_in_0]
set_property HDL_ATTRIBUTE.SIM_ONLY TRUE [get_bd_nets mc_hbmc_ch0_hbmmc_noc_flit_mc_noc2mc_in_0]
set_property HDL_ATTRIBUTE.EXT_CONN TRUE [get_bd_nets mc_hbmc_ch0_hbmmc_noc_flit_mc_noc2mc_in_1]
set_property HDL_ATTRIBUTE.HIDDEN TRUE [get_bd_nets mc_hbmc_ch0_hbmmc_noc_flit_mc_noc2mc_in_1]
set_property HDL_ATTRIBUTE.SIM_ONLY TRUE [get_bd_nets mc_hbmc_ch0_hbmmc_noc_flit_mc_noc2mc_in_1]
set_property HDL_ATTRIBUTE.EXT_CONN TRUE [get_bd_nets mc_hbmc_ch0_hbmmc_noc_flit_mc_noc2mc_in_2]
set_property HDL_ATTRIBUTE.HIDDEN TRUE [get_bd_nets mc_hbmc_ch0_hbmmc_noc_flit_mc_noc2mc_in_2]
set_property HDL_ATTRIBUTE.SIM_ONLY TRUE [get_bd_nets mc_hbmc_ch0_hbmmc_noc_flit_mc_noc2mc_in_2]
set_property HDL_ATTRIBUTE.EXT_CONN TRUE [get_bd_nets mc_hbmc_ch0_hbmmc_noc_flit_mc_noc2mc_in_3]
set_property HDL_ATTRIBUTE.HIDDEN TRUE [get_bd_nets mc_hbmc_ch0_hbmmc_noc_flit_mc_noc2mc_in_3]
set_property HDL_ATTRIBUTE.SIM_ONLY TRUE [get_bd_nets mc_hbmc_ch0_hbmmc_noc_flit_mc_noc2mc_in_3]
set_property HDL_ATTRIBUTE.EXT_CONN TRUE [get_bd_nets mc_hbmc_ch0_hbmmc_noc_flit_mc_nocout_0]
set_property HDL_ATTRIBUTE.HIDDEN TRUE [get_bd_nets mc_hbmc_ch0_hbmmc_noc_flit_mc_nocout_0]
set_property HDL_ATTRIBUTE.SIM_ONLY TRUE [get_bd_nets mc_hbmc_ch0_hbmmc_noc_flit_mc_nocout_0]
set_property HDL_ATTRIBUTE.EXT_CONN TRUE [get_bd_nets mc_hbmc_ch0_hbmmc_noc_flit_mc_nocout_1]
set_property HDL_ATTRIBUTE.HIDDEN TRUE [get_bd_nets mc_hbmc_ch0_hbmmc_noc_flit_mc_nocout_1]
set_property HDL_ATTRIBUTE.SIM_ONLY TRUE [get_bd_nets mc_hbmc_ch0_hbmmc_noc_flit_mc_nocout_1]
set_property HDL_ATTRIBUTE.EXT_CONN TRUE [get_bd_nets mc_hbmc_ch0_hbmmc_noc_flit_mc_nocout_2]
set_property HDL_ATTRIBUTE.HIDDEN TRUE [get_bd_nets mc_hbmc_ch0_hbmmc_noc_flit_mc_nocout_2]
set_property HDL_ATTRIBUTE.SIM_ONLY TRUE [get_bd_nets mc_hbmc_ch0_hbmmc_noc_flit_mc_nocout_2]
set_property HDL_ATTRIBUTE.EXT_CONN TRUE [get_bd_nets mc_hbmc_ch0_hbmmc_noc_flit_mc_nocout_3]
set_property HDL_ATTRIBUTE.HIDDEN TRUE [get_bd_nets mc_hbmc_ch0_hbmmc_noc_flit_mc_nocout_3]
set_property HDL_ATTRIBUTE.SIM_ONLY TRUE [get_bd_nets mc_hbmc_ch0_hbmmc_noc_flit_mc_nocout_3]
set_property HDL_ATTRIBUTE.EXT_CONN TRUE [get_bd_nets mc_hbmc_ch0_hbmmc_noc_pdest_id_mc_noc2mc_in_0]
set_property HDL_ATTRIBUTE.HIDDEN TRUE [get_bd_nets mc_hbmc_ch0_hbmmc_noc_pdest_id_mc_noc2mc_in_0]
set_property HDL_ATTRIBUTE.SIM_ONLY TRUE [get_bd_nets mc_hbmc_ch0_hbmmc_noc_pdest_id_mc_noc2mc_in_0]
set_property HDL_ATTRIBUTE.EXT_CONN TRUE [get_bd_nets mc_hbmc_ch0_hbmmc_noc_pdest_id_mc_noc2mc_in_1]
set_property HDL_ATTRIBUTE.HIDDEN TRUE [get_bd_nets mc_hbmc_ch0_hbmmc_noc_pdest_id_mc_noc2mc_in_1]
set_property HDL_ATTRIBUTE.SIM_ONLY TRUE [get_bd_nets mc_hbmc_ch0_hbmmc_noc_pdest_id_mc_noc2mc_in_1]
set_property HDL_ATTRIBUTE.EXT_CONN TRUE [get_bd_nets mc_hbmc_ch0_hbmmc_noc_pdest_id_mc_noc2mc_in_2]
set_property HDL_ATTRIBUTE.HIDDEN TRUE [get_bd_nets mc_hbmc_ch0_hbmmc_noc_pdest_id_mc_noc2mc_in_2]
set_property HDL_ATTRIBUTE.SIM_ONLY TRUE [get_bd_nets mc_hbmc_ch0_hbmmc_noc_pdest_id_mc_noc2mc_in_2]
set_property HDL_ATTRIBUTE.EXT_CONN TRUE [get_bd_nets mc_hbmc_ch0_hbmmc_noc_pdest_id_mc_noc2mc_in_3]
set_property HDL_ATTRIBUTE.HIDDEN TRUE [get_bd_nets mc_hbmc_ch0_hbmmc_noc_pdest_id_mc_noc2mc_in_3]
set_property HDL_ATTRIBUTE.SIM_ONLY TRUE [get_bd_nets mc_hbmc_ch0_hbmmc_noc_pdest_id_mc_noc2mc_in_3]
set_property HDL_ATTRIBUTE.EXT_CONN TRUE [get_bd_nets mc_hbmc_ch0_hbmmc_noc_pdest_id_mc_nocout_0]
set_property HDL_ATTRIBUTE.HIDDEN TRUE [get_bd_nets mc_hbmc_ch0_hbmmc_noc_pdest_id_mc_nocout_0]
set_property HDL_ATTRIBUTE.SIM_ONLY TRUE [get_bd_nets mc_hbmc_ch0_hbmmc_noc_pdest_id_mc_nocout_0]
set_property HDL_ATTRIBUTE.EXT_CONN TRUE [get_bd_nets mc_hbmc_ch0_hbmmc_noc_pdest_id_mc_nocout_1]
set_property HDL_ATTRIBUTE.HIDDEN TRUE [get_bd_nets mc_hbmc_ch0_hbmmc_noc_pdest_id_mc_nocout_1]
set_property HDL_ATTRIBUTE.SIM_ONLY TRUE [get_bd_nets mc_hbmc_ch0_hbmmc_noc_pdest_id_mc_nocout_1]
set_property HDL_ATTRIBUTE.EXT_CONN TRUE [get_bd_nets mc_hbmc_ch0_hbmmc_noc_pdest_id_mc_nocout_2]
set_property HDL_ATTRIBUTE.HIDDEN TRUE [get_bd_nets mc_hbmc_ch0_hbmmc_noc_pdest_id_mc_nocout_2]
set_property HDL_ATTRIBUTE.SIM_ONLY TRUE [get_bd_nets mc_hbmc_ch0_hbmmc_noc_pdest_id_mc_nocout_2]
set_property HDL_ATTRIBUTE.EXT_CONN TRUE [get_bd_nets mc_hbmc_ch0_hbmmc_noc_pdest_id_mc_nocout_3]
set_property HDL_ATTRIBUTE.HIDDEN TRUE [get_bd_nets mc_hbmc_ch0_hbmmc_noc_pdest_id_mc_nocout_3]
set_property HDL_ATTRIBUTE.SIM_ONLY TRUE [get_bd_nets mc_hbmc_ch0_hbmmc_noc_pdest_id_mc_nocout_3]
set_property HDL_ATTRIBUTE.EXT_CONN TRUE [get_bd_nets mc_hbmc_ch0_hbmmc_noc_valid_mc_noc2mc_in_0]
set_property HDL_ATTRIBUTE.HIDDEN TRUE [get_bd_nets mc_hbmc_ch0_hbmmc_noc_valid_mc_noc2mc_in_0]
set_property HDL_ATTRIBUTE.SIM_ONLY TRUE [get_bd_nets mc_hbmc_ch0_hbmmc_noc_valid_mc_noc2mc_in_0]
set_property HDL_ATTRIBUTE.EXT_CONN TRUE [get_bd_nets mc_hbmc_ch0_hbmmc_noc_valid_mc_noc2mc_in_1]
set_property HDL_ATTRIBUTE.HIDDEN TRUE [get_bd_nets mc_hbmc_ch0_hbmmc_noc_valid_mc_noc2mc_in_1]
set_property HDL_ATTRIBUTE.SIM_ONLY TRUE [get_bd_nets mc_hbmc_ch0_hbmmc_noc_valid_mc_noc2mc_in_1]
set_property HDL_ATTRIBUTE.EXT_CONN TRUE [get_bd_nets mc_hbmc_ch0_hbmmc_noc_valid_mc_noc2mc_in_2]
set_property HDL_ATTRIBUTE.HIDDEN TRUE [get_bd_nets mc_hbmc_ch0_hbmmc_noc_valid_mc_noc2mc_in_2]
set_property HDL_ATTRIBUTE.SIM_ONLY TRUE [get_bd_nets mc_hbmc_ch0_hbmmc_noc_valid_mc_noc2mc_in_2]
set_property HDL_ATTRIBUTE.EXT_CONN TRUE [get_bd_nets mc_hbmc_ch0_hbmmc_noc_valid_mc_noc2mc_in_3]
set_property HDL_ATTRIBUTE.HIDDEN TRUE [get_bd_nets mc_hbmc_ch0_hbmmc_noc_valid_mc_noc2mc_in_3]
set_property HDL_ATTRIBUTE.SIM_ONLY TRUE [get_bd_nets mc_hbmc_ch0_hbmmc_noc_valid_mc_noc2mc_in_3]
set_property HDL_ATTRIBUTE.EXT_CONN TRUE [get_bd_nets mc_hbmc_ch0_hbmmc_noc_valid_mc_nocout_0]
set_property HDL_ATTRIBUTE.HIDDEN TRUE [get_bd_nets mc_hbmc_ch0_hbmmc_noc_valid_mc_nocout_0]
set_property HDL_ATTRIBUTE.SIM_ONLY TRUE [get_bd_nets mc_hbmc_ch0_hbmmc_noc_valid_mc_nocout_0]
set_property HDL_ATTRIBUTE.EXT_CONN TRUE [get_bd_nets mc_hbmc_ch0_hbmmc_noc_valid_mc_nocout_1]
set_property HDL_ATTRIBUTE.HIDDEN TRUE [get_bd_nets mc_hbmc_ch0_hbmmc_noc_valid_mc_nocout_1]
set_property HDL_ATTRIBUTE.SIM_ONLY TRUE [get_bd_nets mc_hbmc_ch0_hbmmc_noc_valid_mc_nocout_1]
set_property HDL_ATTRIBUTE.EXT_CONN TRUE [get_bd_nets mc_hbmc_ch0_hbmmc_noc_valid_mc_nocout_2]
set_property HDL_ATTRIBUTE.HIDDEN TRUE [get_bd_nets mc_hbmc_ch0_hbmmc_noc_valid_mc_nocout_2]
set_property HDL_ATTRIBUTE.SIM_ONLY TRUE [get_bd_nets mc_hbmc_ch0_hbmmc_noc_valid_mc_nocout_2]
set_property HDL_ATTRIBUTE.EXT_CONN TRUE [get_bd_nets mc_hbmc_ch0_hbmmc_noc_valid_mc_nocout_3]
set_property HDL_ATTRIBUTE.HIDDEN TRUE [get_bd_nets mc_hbmc_ch0_hbmmc_noc_valid_mc_nocout_3]
set_property HDL_ATTRIBUTE.SIM_ONLY TRUE [get_bd_nets mc_hbmc_ch0_hbmmc_noc_valid_mc_nocout_3]

validate_bd_design
save_bd_design
